# EAGLE design Angle board (EAGLE 9.6.2)
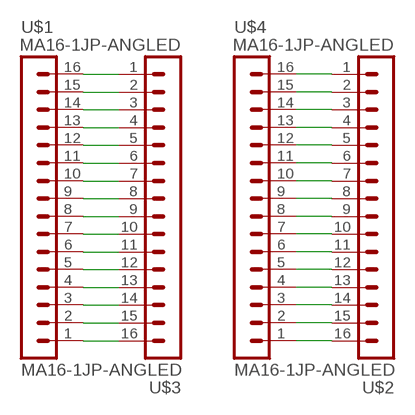
[diagram p0: schematic, sheet 1]

## Parts
U$1  MA16-1JP-ANGLED  MA16-1JP  [SIP-PIN16-1J]
U$2  MA16-1JP-ANGLED  MA16-1JP  [SIP-PIN16-1J]
U$3  MA16-1JP-ANGLED  MA16-1JP  [SIP-PIN16-1J]
U$4  MA16-1JP-ANGLED  MA16-1JP  [SIP-PIN16-1J]

## Nets
AGND: U$1.7 U$2.4 U$3.10 U$4.13
N$1: U$1.1 U$3.16
N$2: U$1.2 U$3.15
N$3: U$1.3 U$3.14
N$4: U$1.4 U$3.13
N$5: U$1.5 U$3.12
N$6: U$1.6 U$3.11
N$8: U$1.8 U$3.9
N$9: U$1.9 U$3.8
N$10: U$1.10 U$3.7
N$11: U$1.11 U$3.6
N$12: U$1.12 U$3.5
N$13: U$1.13 U$3.4
N$14: U$1.14 U$3.3
N$15: U$1.15 U$3.2
N$16: U$1.16 U$3.1
N$17: U$2.16 U$4.1
N$18: U$2.15 U$4.2
N$19: U$2.14 U$4.3
N$20: U$2.13 U$4.4
N$21: U$2.12 U$4.5
N$22: U$2.11 U$4.6
N$23: U$2.10 U$4.7
N$24: U$2.9 U$4.8
N$25: U$2.8 U$4.9
N$26: U$2.7 U$4.10
N$27: U$2.6 U$4.11
N$28: U$2.5 U$4.12
N$30: U$2.3 U$4.14
N$31: U$2.2 U$4.15
N$32: U$2.1 U$4.16

## Library data of the parts
U$1-U$4 = joakim:MA16-1J

## Board
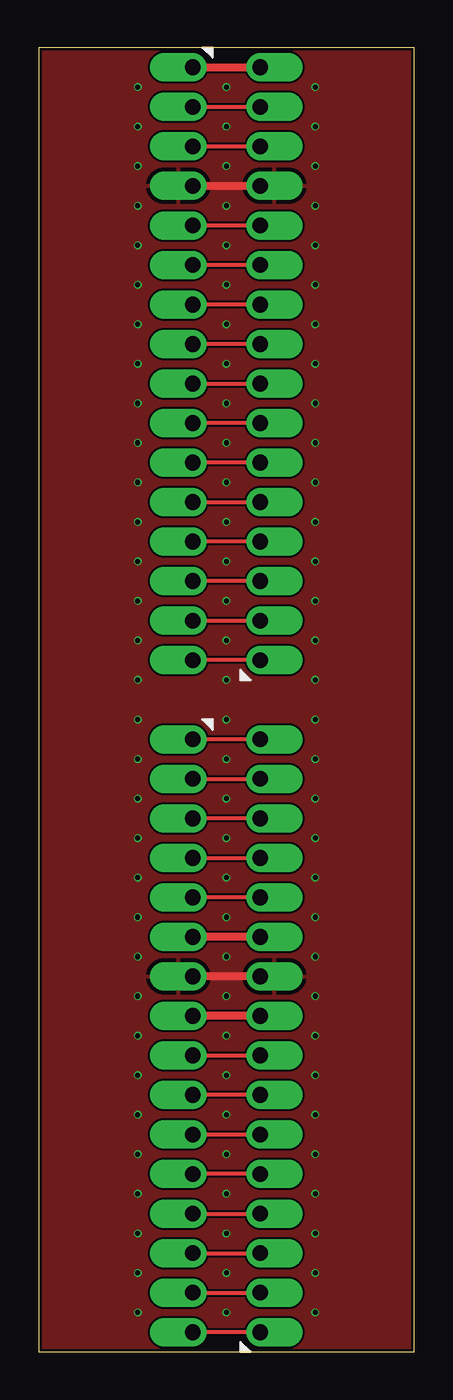
[diagram p1: board, top side]
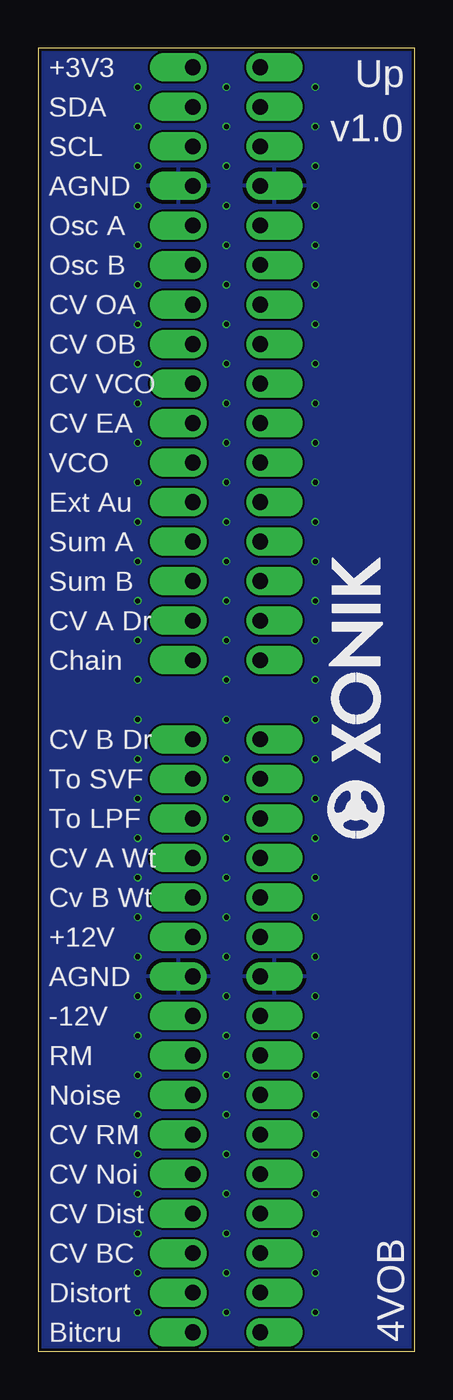
[diagram p2: board, bottom side, seen from below]

Size 24.13 x 83.82 mm. Coordinates in mm from the lower left corner, seen from the top.
Outline: 0,0 24.13,0 24.13,83.82 0,83.82 0,0
Copper layers (1*16): Top 0.035mm / dielectric 1.6mm / Bottom 0.035mm
Design rules "jlcpcb-2layers": minimum track width 5mil, minimum drill 0.3mm, track to track 5mil, track to pad 5mil, pad to pad 5mil, via to via 5mil, smd to smd 5mil, copper to edge 0.2mm, drill to drill 6mil, minimum pad ring 10mil, minimum via ring 3mil, stop-mask expansion 4mil, vias tented up to drill 0mil, thermal gap 10mil

### Footprints (pad centres in the part's own frame; a part is rotated, then mirrored left to right if it is on the bottom)
SIP-PIN16-1J = drill 1.016 offset: 1 -19.05,0; 2 -16.51,0; 3 -13.97,0; 4 -11.43,0; 5 -8.89,0; 6 -6.35,0; 7 -3.81,0; 8 -1.27,0; 9 1.27,0; 10 3.81,0; 11 6.35,0; 12 8.89,0; 13 11.43,0; 14 13.97,0; 15 16.51,0; 16 19.05,0

### Placement (x,y rotation side)
U$1  9.89,20.32 270 top
U$2  9.89,63.5 270 top
U$3  14.23,20.32 90 top
U$4  14.23,63.5 90 top
U$5  [XONIK_LOGO_18]  1.91,33.02 90 bottom

### Tracks (layer width: path | path; a pad name or v marks a point on that pad's centre or on a via)
AGND  (via drill 0.33)
  Top 0.508: U$2.4 U$4.13 | U$3.10 U$1.7
  other vias: 12.06,81.28 6.35,81.28 17.78,81.28 12.06,78.74 12.06,76.2 12.06,73.66 12.06,71.12 12.06,68.58 12.06,66.04 12.06,63.5 12.06,60.96 12.06,58.42 17.78,78.74 17.78,76.2 17.78,73.66 17.78,71.12 17.78,68.58 17.78,66.04 17.78,63.5 17.78,60.96 17.78,58.42 17.78,55.88 17.78,53.34 17.78,50.8 17.78,48.26 17.78,45.72 17.78,43.18 12.06,55.88 12.06,53.34 12.06,50.8 12.06,48.26 12.06,45.72 12.06,43.18 6.35,78.74 6.35,76.2 6.35,73.66 6.35,71.12 6.35,68.58 6.35,66.04 6.35,63.5 6.35,60.96 6.35,58.42 6.35,55.88 6.35,53.34 6.35,50.8 6.35,48.26 6.35,45.72 6.35,43.18 6.35,40.64 6.35,38.1 6.35,35.56 6.35,33.02 6.35,30.48 6.35,27.94 6.35,25.4 6.35,22.86 6.35,20.32 6.35,17.78 6.35,15.24 6.35,12.7 6.35,10.16 6.35,7.62 6.35,5.08 6.35,2.54 12.06,40.64 12.06,38.1 12.06,35.56 12.06,33.02 12.06,30.48 12.06,27.94 12.06,25.4 12.06,22.86 12.06,20.32 12.06,17.78 12.06,15.24 12.06,12.7 12.06,10.16 12.06,7.62 12.06,5.08 12.06,2.54 17.78,40.64 17.78,38.1 17.78,35.56 17.78,33.02 17.78,30.48 17.78,27.94 17.78,25.4 17.78,22.86 17.78,20.32 17.78,17.78 17.78,15.24 17.78,12.7 17.78,10.16 17.78,7.62 17.78,5.08 17.78,2.54
  pour Top: -0.64,84.45 24.77,84.45 24.77,-0.64 -0.64,-0.64
  pour Bottom: -1.27,85.09 25.4,85.09 25.4,-1.27 -1.27,-1.27
N$1
  Top 0.254: U$3.16 U$1.1
N$2
  Top 0.254: U$1.2 U$3.15
N$3
  Top 0.254: U$3.14 U$1.3
N$4
  Top 0.254: U$1.4 U$3.13
N$5
  Top 0.254: U$3.12 U$1.5
N$6
  Top 0.508: U$3.11 U$1.6
N$8
  Top 0.508: U$3.9 U$1.8
N$9
  Top 0.254: U$1.9 U$3.8
N$10
  Top 0.254: U$3.7 U$1.10
N$11
  Top 0.254: U$1.11 U$3.6
N$12
  Top 0.254: U$3.5 U$1.12
N$13
  Top 0.254: U$1.13 U$3.4
N$14
  Top 0.254: U$1.14 U$3.3
N$15
  Top 0.254: U$1.15 U$3.2
N$16
  Top 0.254: U$3.1 U$1.16
N$17
  Top 0.254: U$4.1 U$2.16
N$18
  Top 0.254: U$2.15 U$4.2
N$19
  Top 0.254: U$4.3 U$2.14
N$20
  Top 0.254: U$4.4 U$2.13
N$21
  Top 0.254: U$2.12 U$4.5
N$22
  Top 0.254: U$4.6 U$2.11
N$23
  Top 0.254: U$4.7 U$2.10
N$24
  Top 0.254: U$2.9 U$4.8
N$25
  Top 0.254: U$4.9 U$2.8
N$26
  Top 0.254: U$4.10 U$2.7
N$27
  Top 0.254: U$4.11 U$2.6
N$28
  Top 0.254: U$4.12 U$2.5
N$30
  Top 0.254: U$2.3 U$4.14
N$31
  Top 0.254: U$2.2 U$4.15
N$32
  Top 0.508: U$2.1 U$4.16

### Text on the board
bNames: +3V3 | Up | SDA | v1.0 | SCL | AGND | Osc A | Osc B | CV OA | CV OB | CV VCO | CV EA | VCO | Ext Au | Sum A | Sum B | CV A Dr | Chain | CV B Dr | To SVF | To LPF | CV A Wt | Cv B Wt | +12V | AGND | -12V | RM | Noise | CV RM | CV Noi | CV Dist | CV BC | Distort | 4VOB | Bitcru